# Altium schematic sheet SOUND BUZZER.schdoc
size 200 x 129 mm
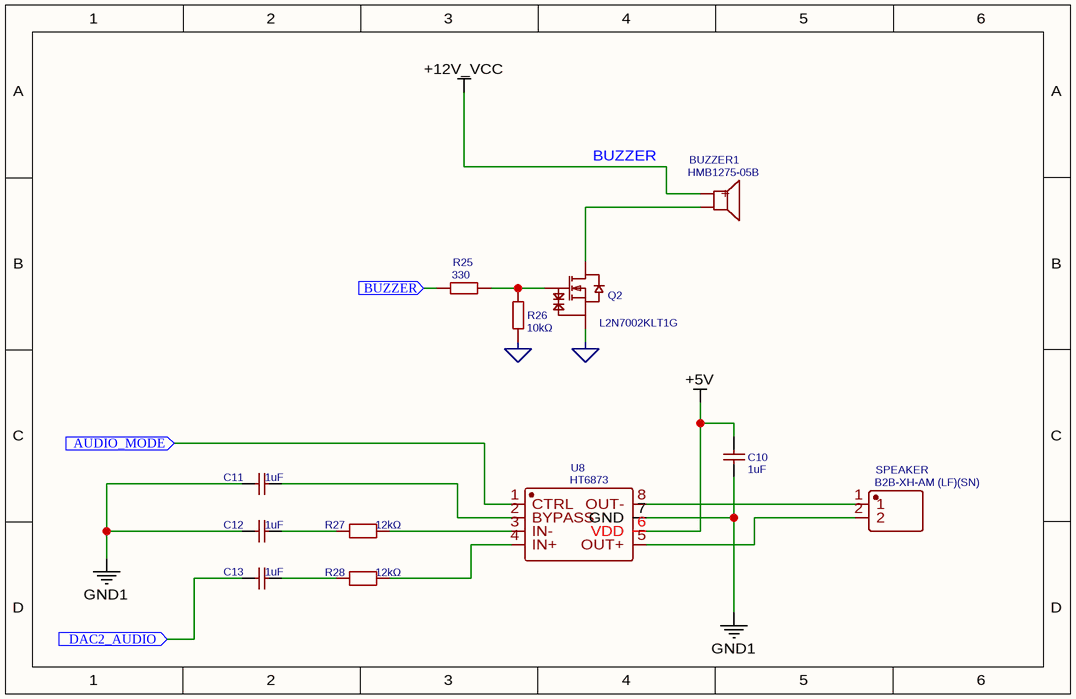
[diagram p0: SOUND BUZZER.schdoc]

## Parts
BUZZER1  HMB1275-05B  [BUZ-TH_BD12.0-P7.60-D0.6-FD]
C10  1uF  [C1206]
C11  1uF  [C1206]
C12  1uF  [C1206]
C13  1uF  [C1206]
Q2  L2N7002KLT1G  [SOT-23-3]
R25  330  [R0805]
R26  10kΩ  [R0805]
R27  12kΩ  [R0805]
R28  12kΩ  [R0805]
SPEAKER  B2B-XH-AM (LF)(SN)  [CONN-TH_B2B-XH-AM-LF-SN]
U8  HT6873  [SOP-8_L4.9-W3.9-P1.27-LS6.0-BL]

## Ports
AUDIO_MODE (in), BUZZER (in), DAC2_AUDIO (in)

## Nets
+5V: C10.1 U8.6(VDD)
+12V_VCC: BUZZER1.1(+)
GND1: C10.2 C11.2 C12.2 Q2.2(S) R26.1 U8.7(GND)
AUDIO_MODE: U8.1(CTRL) ; port AUDIO_MODE
BUZZER: R25.2 ; port BUZZER
DAC2_AUDIO: C13.2 ; port DAC2_AUDIO
NetBUZZER1_2: BUZZER1.2 Q2.3(D)
NetC11_1: C11.1 U8.2(BYPASS)
NetC12_1: C12.1 R27.1
NetC13_1: C13.1 R28.1
NetQ2_1: Q2.1(G) R25.1 R26.2
NetR27_2: R27.2 U8.3(IN-)
NetR28_2: R28.2 U8.4(IN+)
NetSPEAKER_1: SPEAKER.1 U8.8(OUT-)
NetSPEAKER_2: SPEAKER.2 U8.5(OUT+)

## Notes on the sheet
- BUZZER

## Library data of the parts
BUZZER1 = HMB1275-05B: BOM_Manufacturer: HNDZ; Frequency: 2300Hz; BOM_Supplier: LCSC; BOM_Manufacturer Part: HMB1275-05B; BOM_Supplier Part: C96491; BOM_JLCPCB Part Class: Extended Part; spicePre: B; spiceSymbolName: HMB1275-05B
C10-C13 = 1uF: BOM_Manufacturer: YAGEO; BOM_Manufacturer Part: CC1206KKX7R8BB105; nameAlias: Capacitance; BOM_Supplier: LCSC; BOM_Supplier Part: C107184; BOM_JLCPCB Part Class: Extended Part; spicePre: C; spiceSymbolName: CC1206KKX7R8BB105
Q2 = L2N7002KLT1G: BOM_Manufacturer: LRC; BOM_Manufacturer Part: L2N7002SLT1G; BOM_Supplier: LCSC; spicePre: Q; BOM_Supplier Part: C250818
R25 = 330: BOM_Manufacturer: YAGEO; BOM_Manufacturer Part: AC0805FR-07330RL; nameAlias: Resistance (Ohms); Contributor: LCSC; Resistance: 330Ω; BOM_Supplier: LCSC; BOM_Supplier Part: C144564; BOM_JLCPCB Part Class: Extended Part; spicePre: R; spiceSymbolName: AC0805FR-07330RL
R26 = 10kΩ: BOM_Manufacturer: Ever Ohms Tech; BOM_Manufacturer Part: TR0805D10KP0550; Resistance (Ohms): 10K; nameAlias: Resistance; Contributor: LCSC; BOM_Supplier: LCSC; BOM_Supplier Part: C332266; BOM_JLCPCB Part Class: Extended Part; spicePre: R; spiceSymbolName: TR0805D10KP0550
R27 R28 = 12kΩ: BOM_Manufacturer: UNI-ROYAL(Uniroyal Elec); BOM_Manufacturer Part: HP05W3J0123T5E; Resistance (Ohms): 12K; nameAlias: Resistance; Contributor: LCSC; BOM_Supplier: LCSC; BOM_Supplier Part: C414966; BOM_JLCPCB Part Class: Extended Part; spicePre: R; spiceSymbolName: HP05W3J0123T5E
SPEAKER = B2B-XH-AM (LF)(SN): BOM_Manufacturer: JST Sales America; Contributor: LCSC; BOM_Supplier: LCSC; BOM_Supplier Part: C161869; BOM_Manufacturer Part: -; BOM_JLCPCB Part Class: Extended Part; spicePre: C; spiceSymbolName: B2B-XH-AM (LF)(SN)
U8 = HT6873: BOM_Manufacturer: HEROIC; BOM_Supplier: LCSC; BOM_Manufacturer Part: HT6873; BOM_Supplier Part: C94920; BOM_JLCPCB Part Class: Extended Part; spicePre: U; spiceSymbolName: HT6873